# Altium schematic sheet MCU.SchDoc
size A3; SheetNumber: 2; SheetTotal: 5
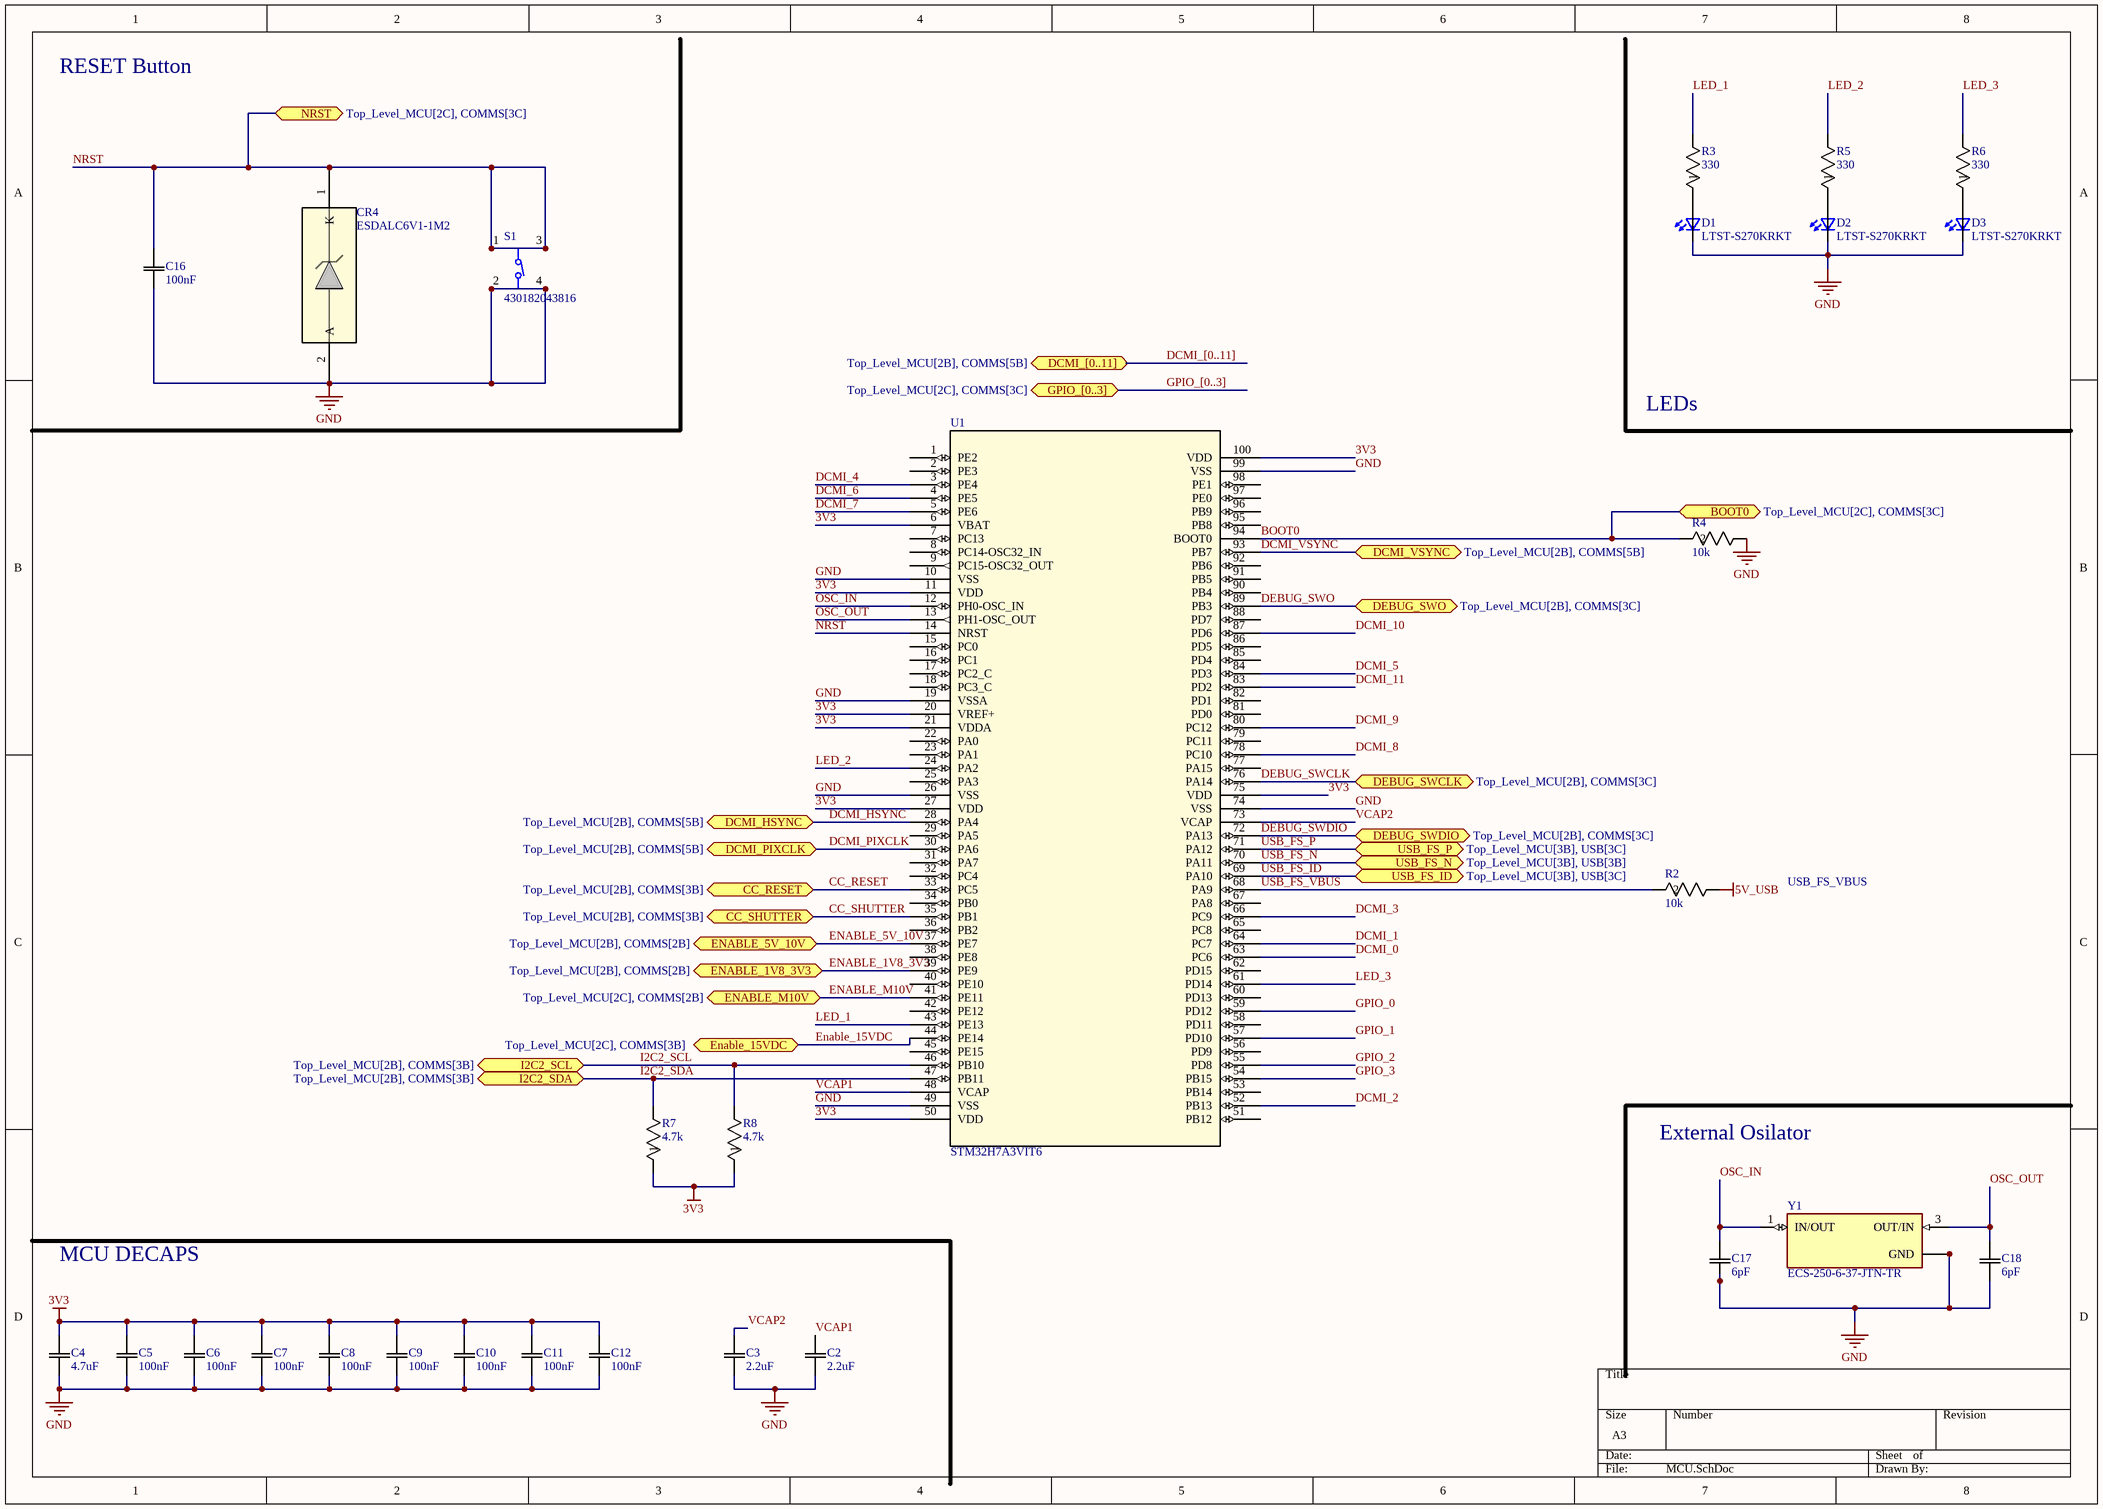
[diagram p0: MCU.SchDoc]

## Parts
C2  2.2uF  [CAP_CL10_SAM]
C3  2.2uF  [CAP_CL10_SAM]
C4  4.7uF  [LMK107_TAY]
C5  100nF  [CAPC10555_55N_KEM]
C6  100nF  [CAPC10555_55N_KEM]
C7  100nF  [CAPC10555_55N_KEM]
C8  100nF  [CAPC10555_55N_KEM]
C9  100nF  [CAPC10555_55N_KEM]
C10  100nF  [CAPC10555_55N_KEM]
C11  100nF  [CAPC10555_55N_KEM]
C12  100nF  [CAPC10555_55N_KEM]
C16  100nF  [CAPC17595_90N_KEM]
C17  6pF  [CAP_06033D104JAT2A]
C18  6pF  [CAP_06033D104JAT2A]
CR4  ESDALC6V1-1M2  [SOD882_STM]
D1  LTST-S270KRKT  [0603]
D2  LTST-S270KRKT  [0603]
D3  LTST-S270KRKT  [0603]
R2  10k  [RC0402N_YAG]
R3  330  [STA_RMCF0603_STP]
R4  10k  [RC0402N_YAG]
R5  330  [STA_RMCF0603_STP]
R6  330  [STA_RMCF0603_STP]
R7  4.7k  [YAG_R0402_YAG]
R8  4.7k  [YAG_R0402_YAG]
S1  430182043816  [430182043816]
U1  STM32H7A3VIT6  [LQFP100]
Y1  ECS-250-6-37-JTN-TR  [XTAL_ECS-250-6-37-JTN-TR]

## Ports
BOOT0 (bidir, see Top_Level_MCU[2C], COMMS[3C]), CC_RESET (bidir, see Top_Level_MCU[2B], COMMS[3B]), CC_SHUTTER (bidir, see Top_Level_MCU[2B], COMMS[3B]), DCMI_[0..11] (bidir, see Top_Level_MCU[2B], COMMS[5B]), DCMI_HSYNC (bidir, see Top_Level_MCU[2B], COMMS[5B]), DCMI_PIXCLK (bidir, see Top_Level_MCU[2B], COMMS[5B]), DCMI_VSYNC (bidir, see Top_Level_MCU[2B], COMMS[5B]), DEBUG_SWCLK (bidir, see Top_Level_MCU[2B], COMMS[3C]), DEBUG_SWDIO (bidir, see Top_Level_MCU[2B], COMMS[3C]), DEBUG_SWO (bidir, see Top_Level_MCU[2B], COMMS[3C]), ENABLE_1V8_3V3 (bidir, see Top_Level_MCU[2B], COMMS[2B]), ENABLE_5V_10V (bidir, see Top_Level_MCU[2B], COMMS[2B]), Enable_15VDC (bidir, see Top_Level_MCU[2C], COMMS[3B]), ENABLE_M10V (bidir, see Top_Level_MCU[2C], COMMS[2B]), GPIO_[0..3] (bidir, see Top_Level_MCU[2C], COMMS[3C]), I2C2_SCL (bidir, see Top_Level_MCU[2B], COMMS[3B]), I2C2_SDA (bidir, see Top_Level_MCU[2B], COMMS[3B]), NRST (bidir, see Top_Level_MCU[2C], COMMS[3C]), USB_FS_ID (bidir, see Top_Level_MCU[3B], USB[3C]), USB_FS_N (bidir, see Top_Level_MCU[3B], USB[3B]), USB_FS_P (bidir, see Top_Level_MCU[3B], USB[3C])

## Nets
3V3: C4.2 C5.2 C6.2 C7.2 C8.2 C9.2 C10.2 C11.2 C12.2 R7.1 R8.1 U1.6(VBAT) U1.11(VDD) U1.20(VREF+) U1.21(VDDA) U1.27(VDD) U1.50(VDD) U1.75(VDD) U1.100(VDD)
5V_USB: R2.1
GND: C2.1 C3.1 C4.1 C5.1 C6.1 C7.1 C8.1 C9.1 C10.1 C11.1 C12.1 C16.1 C17.1(EPAD) C18.1(EPAD) CR4.2(A) D1.1(K2) D2.1(K2) D3.1(K2) R4.1 S1.2 S1.4 U1.10(VSS) U1.19(VSSA) U1.26(VSS) U1.49(VSS) U1.74(VSS) U1.99(VSS) Y1.2(GND) Y1.4(GND)
BOOT0: R4.2 U1.94(BOOT0) ; port BOOT0
CC_RESET: U1.33(PC5) ; port CC_RESET
CC_SHUTTER: U1.35(PB1) ; port CC_SHUTTER
DCMI_0: U1.63(PC6)
DCMI_1: U1.64(PC7)
DCMI_2: U1.52(PB13)
DCMI_3: U1.66(PC9)
DCMI_4: U1.3(PE4)
DCMI_5: U1.84(PD3)
DCMI_6: U1.4(PE5)
DCMI_7: U1.5(PE6)
DCMI_8: U1.78(PC10)
DCMI_9: U1.80(PC12)
DCMI_10: U1.87(PD6)
DCMI_11: U1.83(PD2)
DCMI_HSYNC: U1.28(PA4) ; port DCMI_HSYNC
DCMI_PIXCLK: U1.30(PA6) ; port DCMI_PIXCLK
DCMI_VSYNC: U1.93(PB7) ; port DCMI_VSYNC
DEBUG_SWCLK: U1.76(PA14) ; port DEBUG_SWCLK
DEBUG_SWDIO: U1.72(PA13) ; port DEBUG_SWDIO
DEBUG_SWO: U1.89(PB3) ; port DEBUG_SWO
ENABLE_1V8_3V3: U1.39(PE9) ; port ENABLE_1V8_3V3
ENABLE_5V_10V: U1.37(PE7) ; port ENABLE_5V_10V
Enable_15VDC: U1.44(PE14) ; port Enable_15VDC
ENABLE_M10V: U1.41(PE11) ; port ENABLE_M10V
GPIO_0: U1.59(PD12)
GPIO_1: U1.57(PD10)
GPIO_2: U1.55(PD8)
GPIO_3: U1.54(PB15)
I2C2_SCL: R8.2 U1.46(PB10) ; port I2C2_SCL
I2C2_SDA: R7.2 U1.47(PB11) ; port I2C2_SDA
LED_1: R3.2 U1.43(PE13)
LED_2: R5.2 U1.24(PA2)
LED_3: R6.2 U1.61(PD14)
NRST: C16.2 CR4.1(K) S1.1 S1.3 U1.14(NRST) ; port NRST
OSC_IN: C17.2(EPAD) U1.12(PH0-OSC_IN) Y1.1(IN/OUT)
OSC_OUT: C18.2(EPAD) U1.13(PH1-OSC_OUT) Y1.3(OUT/IN)
USB_FS_ID: U1.69(PA10) ; port USB_FS_ID
USB_FS_N: U1.70(PA11) ; port USB_FS_N
USB_FS_P: U1.71(PA12) ; port USB_FS_P
USB_FS_VBUS: R2.2 U1.68(PA9)
VCAP1: C2.2 U1.48(VCAP)
VCAP2: C3.2 U1.73(VCAP)
NetD1_2: D1.2(A2) R3.1
NetD2_2: D2.2(A2) R5.1
NetD3_2: D3.2(A2) R6.1

Not connected (* = marked no-connect by the designer): U1 1(PE2) 2(PE3) 7(PC13) 8(PC14-OSC32_IN) 9(PC15-OSC32_OUT) 15(PC0) 16(PC1) 17(PC2_C) 18(PC3_C) 22(PA0) 23(PA1) 25(PA3) 29(PA5) 31(PA7) 32(PC4) 34(PB0) 36(PB2) 38(PE8) 40(PE10) 42(PE12) 45(PE15) 51(PB12) 53(PB14) 56(PD9) 58(PD11) 60(PD13) 62(PD15) 65(PC8) 67(PA8) 77(PA15) 79(PC11) 81(PD0) 82(PD1) 85(PD4) 86(PD5) 88(PD7) 90(PB4) 91(PB5) 92(PB6) 95(PB8) 96(PB9) 97(PE0) 98(PE1)

## Buses and harness runs
bus DCMI_[0..11] = port DCMI_[0..11]
bus GPIO_[0..3] = port GPIO_[0..3]

## Notes on the sheet
- RESET Button
- LEDs
- USB_FS_VBUS
- External Osilator
- MCU DECAPS

## Library data of the parts
C2 C3 = CL10B225KP8NNNC: No Description Available; Manufacturer_Name: Samsung; Copyright: Copyright (C) 2025 Ultra Librarian. All rights reserved.; Manufacturer_Part_Number: CL10B225KP8NNNC
C4 = LMK107BJ475MAHT: No Description Available; Manufacturer_Name: TAIYO YUDEN; Copyright: Copyright (C) 2025 Ultra Librarian. All rights reserved.; Manufacturer_Part_Number: LMK107BJ475MAHT
C5-C12 = C0402C104K4RACTU: SMD Comm X7R, Ceramic, 0.1 uF, 10%, 16 VDC, X7R, SMD, MLCC, Temperature Stable, Class II, 0402; Manufacturer_Name: Kemet; Copyright: Copyright (C) 2025 Ultra Librarian. All rights reserved.; Manufacturer_Part_Number: C0402C104K4RACTU
C16 = C0603C104K9PACTU: SMD Comm X5R, Ceramic, 0.1 uF, 10%, 6.3 VDC, X5R, SMD, MLCC, Temperature Stable, Class II, 0603; Manufacturer_Name: Kemet; Copyright: Copyright (C) 2025 Ultra Librarian. All rights reserved.; Manufacturer_Part_Number: C0603C104K9PACTU
C17 C18 = 06035A6R0JAT2A: No Description Available; Manufacturer_Name: KYOCERA AVX; Copyright: Copyright (C) 2025 Ultra Librarian. All rights reserved.; Manufacturer_Part_Number: 06035A6R0JAT2A
CR4 = ESDALC6V1-1M2: Single line low capacitance Transil&#8482;, transient surge voltage suppressor (TVS) for ESD protection; Manufacturer_Name: STMicroelectronics; Copyright: Copyright (C) 2025 Ultra Librarian. All rights reserved.; Manufacturer_Part_Number: ESDALC6V1-1M2; RefDes: RefDes; Type: Type
D1-D3 = LTST-S270KRKT: http://octopart.com/ltst-c190tbkt-lite-on-550003; MF: {'manufacturer': u'Lite-On Inc.'}; Package: None; Price: None; Value: *; MP: LTST-S270KRKT; Availability: Unavailable
R2 R4 = RC0402FR-0710KL: RES; SMT (0402); 10K; 1%; +/-100PPM/DEGC; 0.0630W; Manufacturer_Name: Yageo; Copyright: Copyright (C) 2025 Ultra Librarian. All rights reserved.; Manufacturer_Part_Number: RC0402FR-0710KL
R3 R5 R6 = RMCF0603FT330R: No Description Available; Manufacturer_Name: Stackpole International; Copyright: Copyright (C) 2025 Ultra Librarian. All rights reserved.; Manufacturer_Part_Number: RMCF0603FT330R
R7 R8 = RC0402FR-074K7L: Description; Manufacturer_Name: Yageo; Copyright: Copyright (C) 2025 Ultra Librarian. All rights reserved.; Manufacturer_Part_Number: RC0402FR-074K7L
S1 = 430182043816: 6*6mm vertical type, SMT, height 4.3mm, black actuator, 160gf, T&R; MF: Wurth Electronics; SnapEDA_Link: https://www.snapeda.com/parts/430182043816/Wurth+Electronics/view-part/?ref=snap; Package: None; Value: *; MP: 430182043816; Check_prices: https://www.snapeda.com/parts/430182043816/Wurth+Electronics/view-part/?ref=eda
U1 = STM32H7A3VIT6: High-performance and DSP with DP-FPU, Arm Cortex-M7  MCU with 2MBytes of Flash memory, 1376 KB SRAM, 280 MHz CPU, L1 cache, graphic accelerations, external memory interfaces, SMPS and large set of peripherals; Manufacturer_Name: STMicroelectronics; Copyright: Copyright (C) 2025 Ultra Librarian. All rights reserved.; Manufacturer_Part_Number: STM32H7A3VIT6; RefDes: RefDes; Type: Type
Y1 = ECS-250-6-37-JTN-TR: SMD Crystal 2.0 x 1.6 x 0.45 mm ceramic package; Package: None; Price: None; Value: *; MP: ECS-250-6-37-JTN-TR; Availability: Unavailable; ComponentLink1Description: New link; ComponentLink1URL: *